# Altium schematic sheet Cyusb3314_Interface.SchDoc
size 401 x 330 mm
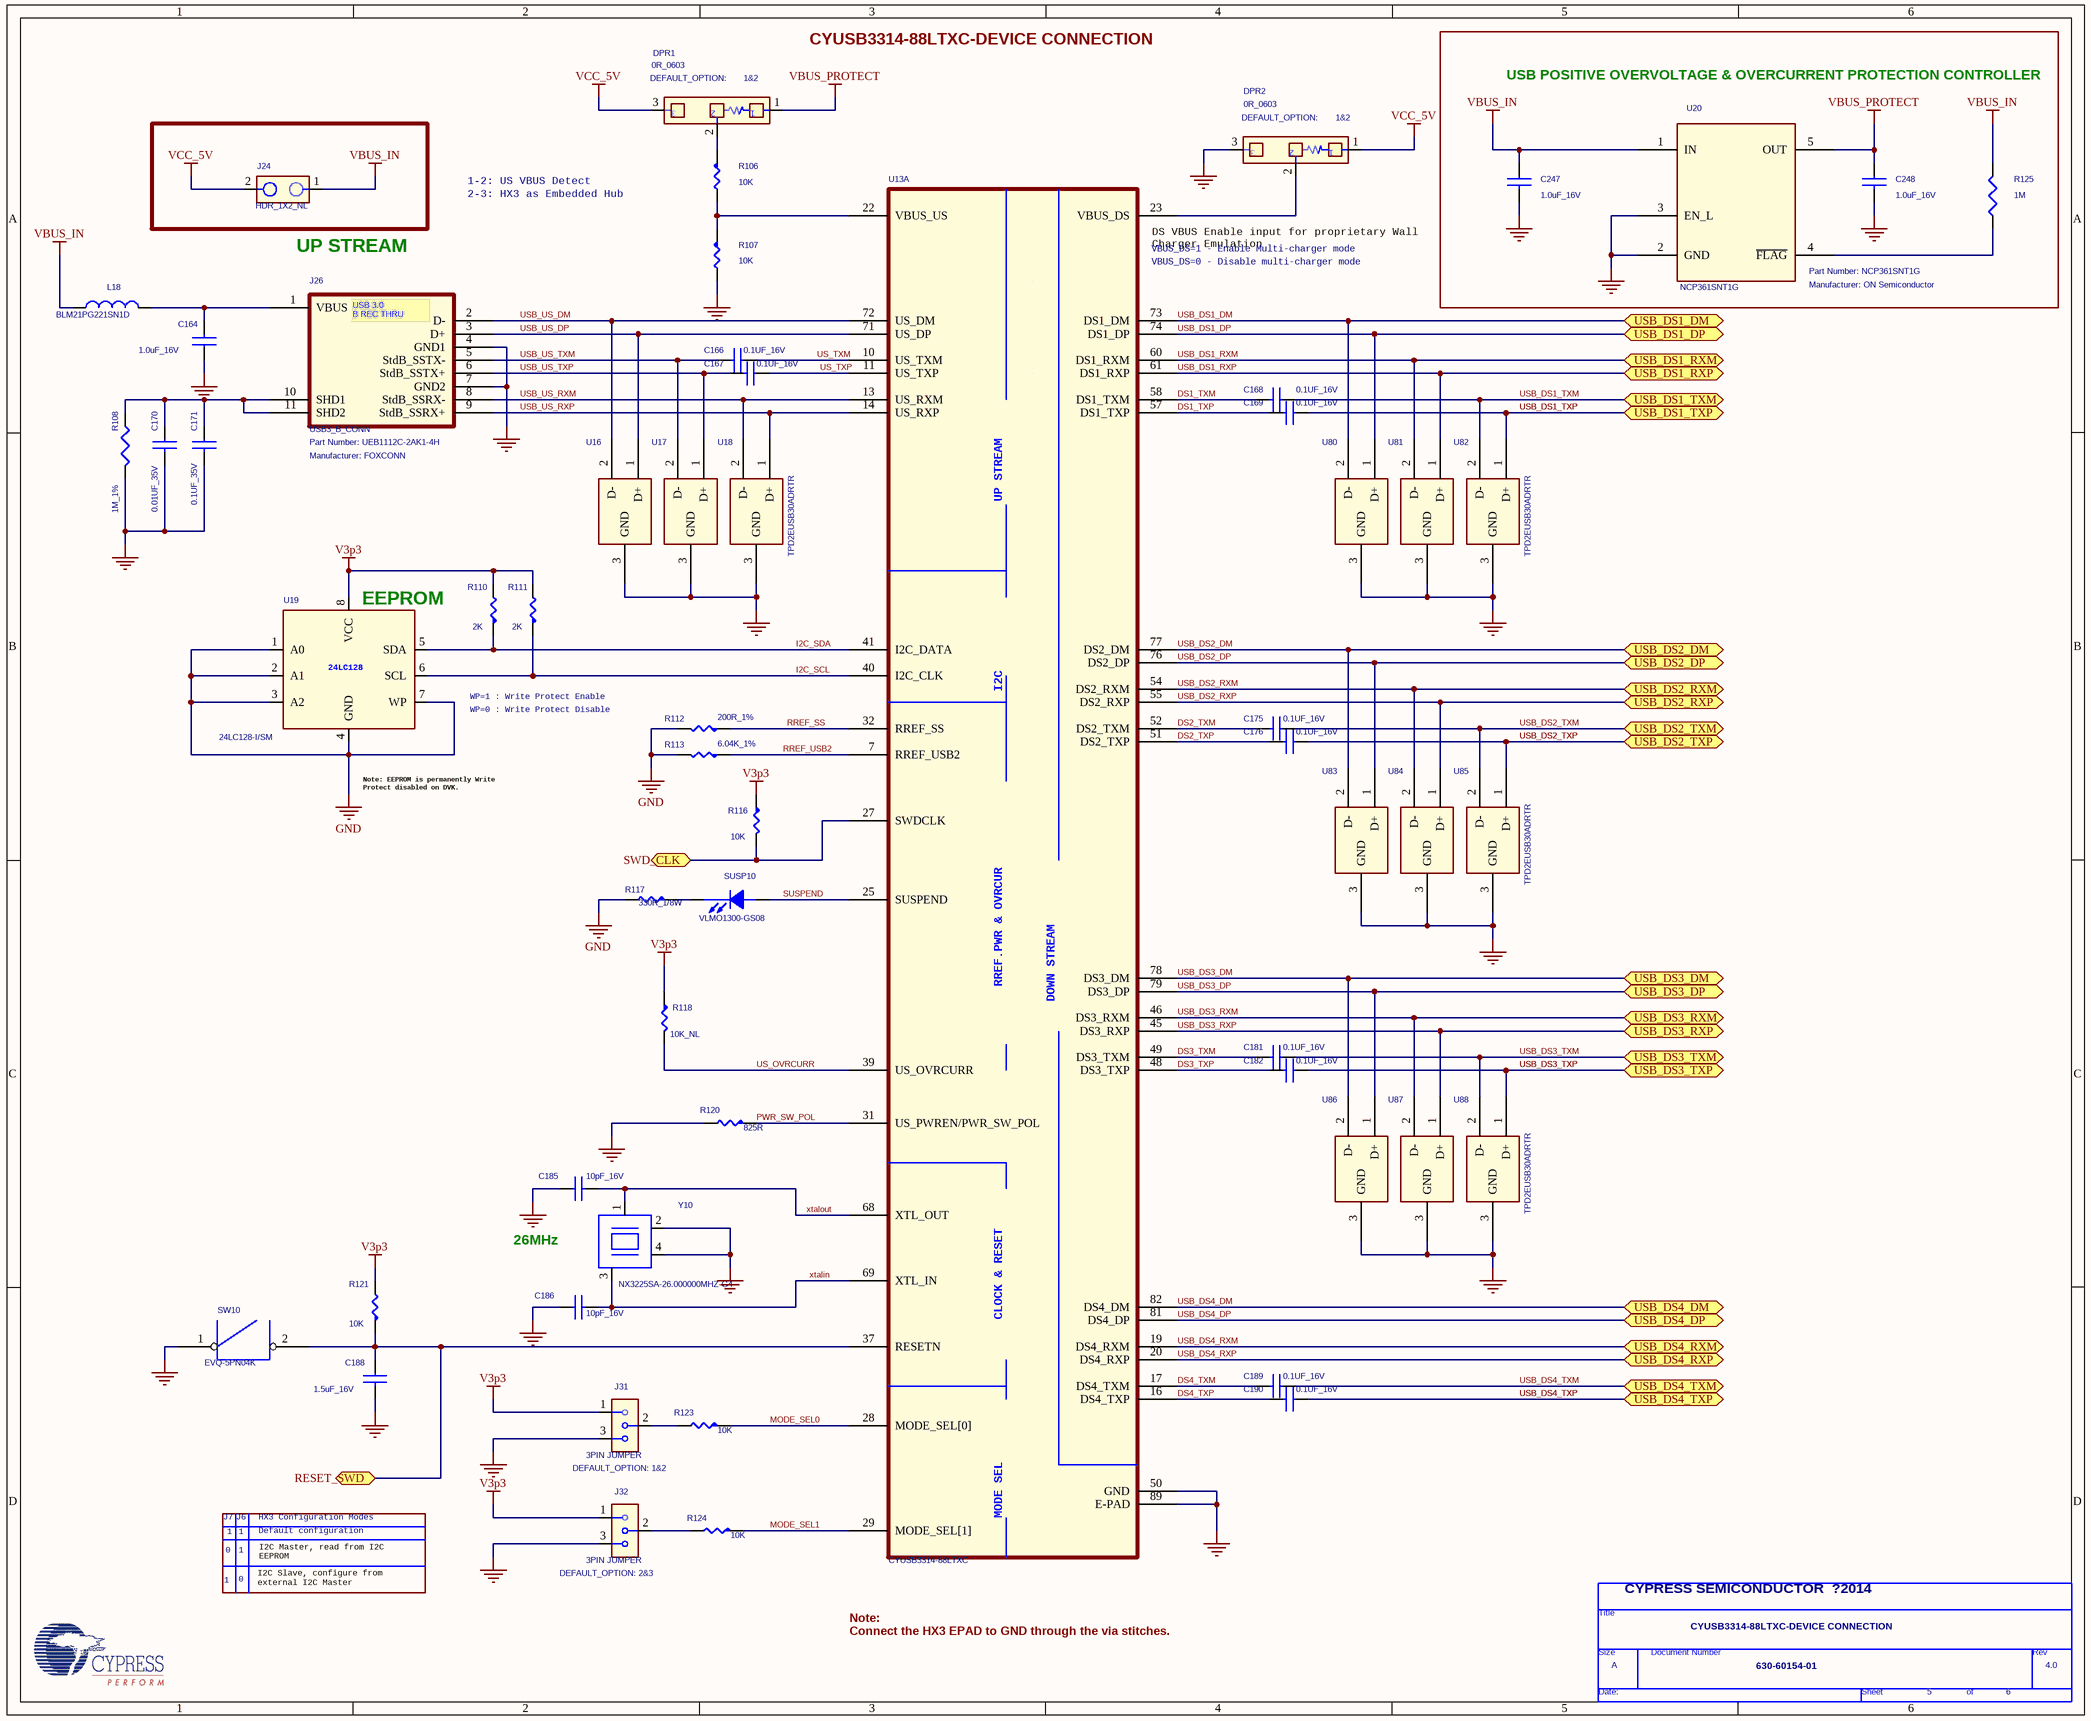
[diagram p0: Cyusb3314_Interface.SchDoc]

## Parts
*  Page Count: 6  Page Number: 5  Page Size: A  Title: CYUSB3314-88LTXC-DEVICE CONNECTION  RevCode: 4.0  Doc: 630-60154-01  (hidden comment: TitleBlock0)  (graphical)
C164  1.0uF_16V  [CAPC1005X56M]
C166  0.1UF_16V  [CAPC1005X56M]
C167  0.1UF_16V  [CAPC1005X56M]
C168  0.1UF_16V  [CAPC1005X56M]
C169  0.1UF_16V  [CAPC1005X56M]
C170  0.01UF_35V  [CAPC1005X55M]
C171  0.1UF_35V  [CAPC1005X55M]
C175  0.1UF_16V  [CAPC1005X56M]
C176  0.1UF_16V  [CAPC1005X56M]
C181  0.1UF_16V  [CAPC1005X56M]
C182  0.1UF_16V  [CAPC1005X56M]
C185  10pF_16V  [CAPC1608X90M]
C186  10pF_16V  [CAPC1608X90M]
C188  1.5uF_16V  [CAPC1608X90M]
C189  0.1UF_16V  [CAPC1005X56M]
C190  0.1UF_16V  [CAPC1005X56M]
C247  1.0uF_16V  [CAPC1608X90M]
C248  1.0uF_16V  [CAPC1608X90M]
DPR1  0R_0603  Mounting Status: 1&2  [RC0603_3P]
DPR2  0R_0603  Mounting Status: 1&2  [RC0603_3P]
J24  HDR_1X2_NL  [SAMTEC_TSW-102-08-G-S]
J26  USB3_B_CONN  Manufacturer: FOXCONN  [FOXCONN_UEB1112C-2AK1-4H]
J31  3PIN JUMPER  DEFAULT_OPTION: 1&2  [TE_3-644456-3]
J32  3PIN JUMPER  DEFAULT_OPTION: 2&3  [TE_3-644456-3]
L18  BLM21PG221SN1D  [INDC2012X105M]
R106  10K  [RESC1005X40M]
R107  10K  [RESC1005X40M]
R108  1M_1%  [RESC1608X55M]
R110  2K  [RESC1608X55M]
R111  2K  [RESC1608X55M]
R112  200R_1%  [RESC1608X50M]
R113  6.04K_1%  [RESC1608X55M_A]
R116  10K  [RESC1005X40M]
R117  330R_1/8W  [RESC1608X50M]
R118  10K_NL  [RESC1005X40M]
R120  825R  [RESC1005X40M]
R121  10K  [RESC1608X55M]
R123  10K  [RESC1005X40M]
R124  10K  [RESC1005X40M]
R125  1M  [RESC1005X40M]
SUSP10  VLMO1300-GS08  [LEDC1608X80M]
SW10  EVQ-5PN04K  [SW_EVQ-5PN04K]
U13  CYUSB3314-88LTXC  [QFN40P1000X1000X100-89M]  (part A of 3)
U16  TPD2EUSB30ADRTR  [SOTFL35P100X50-3M]  (value not drawn)
U17  TPD2EUSB30ADRTR  [SOTFL35P100X50-3M]  (value not drawn)
U18  TPD2EUSB30ADRTR  [SOTFL35P100X50-3M]
U19  24LC128-I/SM  [SOIC127P790X203-8M]
U20  NCP361SNT1G  Manufacturer: ON Semiconductor  [SOP95P275X110-5M]
U80  TPD2EUSB30ADRTR  [SOTFL35P100X50-3M]  (value not drawn)
U81  TPD2EUSB30ADRTR  [SOTFL35P100X50-3M]  (value not drawn)
U82  TPD2EUSB30ADRTR  [SOTFL35P100X50-3M]
U83  TPD2EUSB30ADRTR  [SOTFL35P100X50-3M]  (value not drawn)
U84  TPD2EUSB30ADRTR  [SOTFL35P100X50-3M]  (value not drawn)
U85  TPD2EUSB30ADRTR  [SOTFL35P100X50-3M]
U86  TPD2EUSB30ADRTR  [SOTFL35P100X50-3M]  (value not drawn)
U87  TPD2EUSB30ADRTR  [SOTFL35P100X50-3M]  (value not drawn)
U88  TPD2EUSB30ADRTR  [SOTFL35P100X50-3M]
Y10  NX3225SA-26.000000MHZ-G4  [OSCCC250X320X70-4M]

## Blocks framed on the sheet
USB POSITIVE OVERVOLTAGE & OVERCURRENT PROTECTION CONTROLLER: C247 C248 R125 U20

## Ports
RESET_SWD (bidir), SWD_CLK (bidir), USB_DS1_DM (bidir), USB_DS1_DP (bidir), USB_DS1_RXM (bidir), USB_DS1_RXP (bidir), USB_DS1_TXM (bidir), USB_DS1_TXP (bidir), USB_DS2_DM (bidir), USB_DS2_DP (bidir), USB_DS2_RXM (bidir), USB_DS2_RXP (bidir), USB_DS2_TXM (bidir), USB_DS2_TXP (bidir), USB_DS3_DM (bidir), USB_DS3_DP (bidir), USB_DS3_RXM (bidir), USB_DS3_RXP (bidir), USB_DS3_TXM (bidir), USB_DS3_TXP (bidir), USB_DS4_DM (bidir), USB_DS4_DP (bidir), USB_DS4_RXM (bidir), USB_DS4_RXP (bidir), USB_DS4_TXM (bidir), USB_DS4_TXP (bidir)

## Nets
GND: C164.1 C170.2 C171.2 C185.1 C186.1 C188.2 C247.2 C248.2 DPR2.3 J26.4(GND1) J26.7(GND2) J31.3 J32.3 R107.2 R108.2 R112.2 R113.2 R117.2 R120.2 SW10.1 U13.50(GND) U13.89(E-PAD) U16.3(GND) U17.3(GND) U18.3(GND) U19.1(A0) U19.2(A1) U19.3(A2) U19.4(GND) U19.7(WP) U20.2(GND) U20.3(EN_L) U80.3(GND) U81.3(GND) U82.3(GND) U83.3(GND) U84.3(GND) U85.3(GND) U86.3(GND) U87.3(GND) U88.3(GND) Y10.2 Y10.4
V3p3: J31.1 J32.1 R110.2 R111.2 R116.1 R118.1 R121.2 U19.8(VCC)
VBUS_IN: C247.1 J24.1 L18.1 R125.2 U20.1(IN)
VBUS_PROTECT: C248.1 DPR1.1 U20.5(OUT)
VCC_5V: DPR1.3 DPR2.1 J24.2
DS1_TXM: C168.2 U13.58(DS1_TXM)
DS1_TXP: C169.2 U13.57(DS1_TXP)
DS2_TXM: C175.2 U13.52(DS2_TXM)
DS2_TXP: C176.2 U13.51(DS2_TXP)
DS3_TXM: C181.2 U13.49(DS3_TXM)
DS3_TXP: C182.2 U13.48(DS3_TXP)
DS4_TXM: C189.2 U13.17(DS4_TXM)
DS4_TXP: C190.2 U13.16(DS4_TXP)
I2C_SCL: R111.1 U13.40(I2C_CLK) U19.6(SCL)
I2C_SDA: R110.1 U13.41(I2C_DATA) U19.5(SDA)
MODE_SEL0: R123.1 U13.28(MODE_SEL[0])
MODE_SEL1: R124.1 U13.29(MODE_SEL[1])
PWR_SW_POL: R120.1 U13.31(US_PWREN/PWR_SW_POL)
RESET_SWD: C188.1 R121.1 SW10.2 U13.37(RESETN) ; port RESET_SWD
RREF_SS: R112.1 U13.32(RREF_SS)
RREF_USB2: R113.1 U13.7(RREF_USB2)
SUSPEND: SUSP10.1(ANODE) U13.25(SUSPEND)
SWD_CLK: R116.2 U13.27(SWDCLK) ; port SWD_CLK
US_OVRCURR: R118.2 U13.39(US_OVRCURR)
US_TXM: C166.1 U13.10(US_TXM)
US_TXP: C167.1 U13.11(US_TXP)
USB_DS1_DM: U13.73(DS1_DM) U80.2(D-) ; port USB_DS1_DM
USB_DS1_DP: U13.74(DS1_DP) U80.1(D+) ; port USB_DS1_DP
USB_DS1_RXM: U13.60(DS1_RXM) U81.2(D-) ; port USB_DS1_RXM
USB_DS1_RXP: U13.61(DS1_RXP) U81.1(D+) ; port USB_DS1_RXP
USB_DS1_TXM: C168.1 U82.2(D-) ; port USB_DS1_TXM
USB_DS1_TXP: C169.1 U82.1(D+) ; port USB_DS1_TXP
USB_DS2_DM: U13.77(DS2_DM) U83.2(D-) ; port USB_DS2_DM
USB_DS2_DP: U13.76(DS2_DP) U83.1(D+) ; port USB_DS2_DP
USB_DS2_RXM: U13.54(DS2_RXM) U84.2(D-) ; port USB_DS2_RXM
USB_DS2_RXP: U13.55(DS2_RXP) U84.1(D+) ; port USB_DS2_RXP
USB_DS2_TXM: C175.1 U85.2(D-) ; port USB_DS2_TXM
USB_DS2_TXP: C176.1 U85.1(D+) ; port USB_DS2_TXP
USB_DS3_DM: U13.78(DS3_DM) U86.2(D-) ; port USB_DS3_DM
USB_DS3_DP: U13.79(DS3_DP) U86.1(D+) ; port USB_DS3_DP
USB_DS3_RXM: U13.46(DS3_RXM) U87.2(D-) ; port USB_DS3_RXM
USB_DS3_RXP: U13.45(DS3_RXP) U87.1(D+) ; port USB_DS3_RXP
USB_DS3_TXM: C181.1 U88.2(D-) ; port USB_DS3_TXM
USB_DS3_TXP: C182.1 U88.1(D+) ; port USB_DS3_TXP
USB_DS4_DM: U13.82(DS4_DM) ; port USB_DS4_DM
USB_DS4_DP: U13.81(DS4_DP) ; port USB_DS4_DP
USB_DS4_RXM: U13.19(DS4_RXM) ; port USB_DS4_RXM
USB_DS4_RXP: U13.20(DS4_RXP) ; port USB_DS4_RXP
USB_DS4_TXM: C189.1 ; port USB_DS4_TXM
USB_DS4_TXP: C190.1 ; port USB_DS4_TXP
USB_US_DM: J26.2(D-) U13.72(US_DM) U16.2(D-)
USB_US_DP: J26.3(D+) U13.71(US_DP) U16.1(D+)
USB_US_RXM: J26.8(StdB_SSRX-) U13.13(US_RXM) U18.2(D-)
USB_US_RXP: J26.9(StdB_SSRX+) U13.14(US_RXP) U18.1(D+)
USB_US_TXM: C166.2 J26.5(StdB_SSTX-) U17.2(D-)
USB_US_TXP: C167.2 J26.6(StdB_SSTX+) U17.1(D+)
xtalin: C186.2 U13.69(XTL_IN) Y10.3
xtalout: C185.2 U13.68(XTL_OUT) Y10.1
NetC164_2: C164.2 J26.1(VBUS) L18.2
NetC170_1: C170.1 C171.1 J26.10(SHD1) J26.11(SHD2) R108.1
NetDPR1_2: DPR1.2 R106.1
NetDPR2_2: DPR2.2 U13.23(VBUS_DS)
NetJ31_2: J31.2 R123.2
NetJ32_2: J32.2 R124.2
NetR106_2: R106.2 R107.1 U13.22(VBUS_US)
NetR117_1: R117.1 SUSP10.2(CATHODE)
NetR125_1: R125.1 U20.4(~{FLAG})

## Notes on the sheet
- CYUSB3314-88LTXC-DEVICE CONNECTION
- 1-2: US VBUS Detect
- 2-3: HX3 as Embedded Hub
- UP STREAM
- (near U13) DS VBUS Enable input for proprietary Wall
  Charger Emulation
- (near U13) VBUS_DS=0 - Disable multi-charger mode
- (near U13) VBUS_DS=1 - Enable Multi-charger mode
- (near U19) EEPROM
- WP=1 : Write Protect Enable
- WP=0 : Write Protect Disable
- (near U19) Note: EEPROM is permanently Write
  Protect disabled on DVK.
- 26MHz
- J7
- 1
- J6
- HX3 Configuration Modes
- Default configuration
- 0
- I2C Slave, configure from
  external I2C Master
- I2C Master, read from I2C
  EEPROM
- (near *) CYPRESS SEMICONDUCTOR  ?2014
- Note:
  Connect the HX3 EPAD to GND through the via stitches.
- (in symbol CYUSB3314-88LTXC_2, part A) UP STREAM; I2C; RREF.PWR & OVRCUR; DOWN STREAM; CLOCK & RESET; MODE SEL
- (in symbol TitleBlock0) Title; Size; Document Number; Rev; Date:; Sheet; of
- (in symbol UEB1112C-2AK1-4H) USB 3.0 / B REC THRU

## Library data of the parts
C164 C166-C169 C175 C176 C181 C182 C185 C186 C189 C190 = CAPACITOR NON-POL
  C164 C175 C176 C189 C190: Manufacturer: *; Part Number: *
  C181: Manufacturer: *
C170 = CAPACITOR NON-POL: Part Number: C1005X7R1V103M050BB; Manufacturer: *
C171 = CAPACITOR NON-POL: Part Number: C1005X7R1V104K050BB
C188 = CAPACITOR NON-POL: CAP CER 1.5UF 10V 10% X7R 0805; Manufacturer: TDK Corporation; Lead Free: YES
C247 C248 = CAP: CAP - CER, 1uF, 10V, +/-10%, X5R, 0402; Part Class: CAPACITORS; Num Pins: 2; Item Num: P03-15479R; RoHS Compliant: Yes; Lead Free Status: Yes
DPR1 DPR2 = DPR12_0: Resistor, 4.7K, 0402, 1/10W, 5%; Part Number: ERJ-2GEJ472X
J24 = HEADER_1x2: Manufacturer: Samtec Inc; Part Number: TSW-102-08-G-S; Lead Free: YES
J26 = UEB1112C-2AK1-4H: USB 3.0 B Series Right Angle,T/H 9 Pos; Lead Free: YES; Part Number: UEB1112C-2AK1-4H
J31 J32 = 3PIN JUM: CONN HEADER VERT 3POS .100 TIN; Part Number: 3-644456-3; Manufacturer: Tyco Electronics; Type: Single Row,3Pin Header
L18 = INDUCTOR: FERRITE CHIP 220 OHM 2A 0805; Manufacturer: Murata; Lead Free: YES; Part Number: BLM21PG221SN1D
R106 = R_Dup1: Manufacturer: Panasonic; Part Number: ERJ-2GE0R00X
R107 = R_Dup1: Part Number: ERJ-2RKF4990X; Manufacturer: Panasonic
R108 = R: RES 1M OHM 1/10W 1% 0603 SMD; Part Number: ERJ-3EKF1004V; Manufacturer: Panasonic
R110 = R_Dup1: RES 2.00K OHM 1/10W 1% 0603 SMD; Manufacturer: Rohm Semiconductor; Part Number: MCR03EZPFX2001; Lead Free: YES
R111 = R_Dup1: RES 2.00K OHM 1/10W 1% 0603 SMD; Part Number: MCR03EZPFX2001; Manufacturer: Rohm Semiconductor; Lead Free: YES
R112 = R_Dup1: RES 200 OHM 1% 0603 SMD; Manufacturer: Stackpole; Part Number: RNCP0603FTD200R
R113 = R_Dup1: RES 6.04K OHM .25W 1% 0603 SMD; Part Number: CRCW06036K04FKEAHP; Manufacturer: Vishay Dale
R116 = R_Dup1: RES 10.0K OHM 1/10W 1% 0603 SMD; Manufacturer: Panasonic - ECG; Part Number: ERJ-3EKF1002V; Lead Free: YES
R117 = R_Dup1: Lead Free: YES
R118 = R_Dup1: RES 10.0K OHM 1/10W 1% 0603 SMD; Part Number: ERJ-3EKF1002V; Manufacturer: Panasonic - ECG; Lead Free: YES
R120 R123 R124 = R_Dup1: Manufacturer: Panasonic; Part Number: ERJ-2RKF49.9X
R121 = R_Dup1: Part Number: ERJ-2RKF49.9X; Manufacturer: Panasonic
R125 = R: RES 1.00M OHM 1/10W 1% 0402 SMD; Manufacturer: Panasonic; Part Number: ERJ-2RKF1004X
SUSP10 = LED: Part Number: VLMO1300-GS08
SW10 = B3U1000P: Part Number: EVQ-5PN04K
U13 = CYUSB3314-88LTXC_2: Part Number: CYUSB3314-88LTXC
U19 = 24LC128: IC EEPROM 128KBIT 400KHZ 8SOIC; Manufacturer: Microchip Technology; Lead Free: YES; Part Number: 24LC128-I/SM
U20 = NCP361SNT1G_0: IC USB POS OVP/OC_TSOP5; Part Number: NCP361SNT1G
Y10 = CRYSTAL_1: Manufacturer: NDK; Part Number: NX3225SA-26.000000MHZ-G4
* = TitleBlock0: Page Create Date: March  8, 1995
U16-U18 U80-U88 = TPD2EUSB30ADRTR: Part Number: TPD2EUSB30ADRTR